# EAGLE design H09R9x (EAGLE 9.6.2)

## Sheet 1 of 2
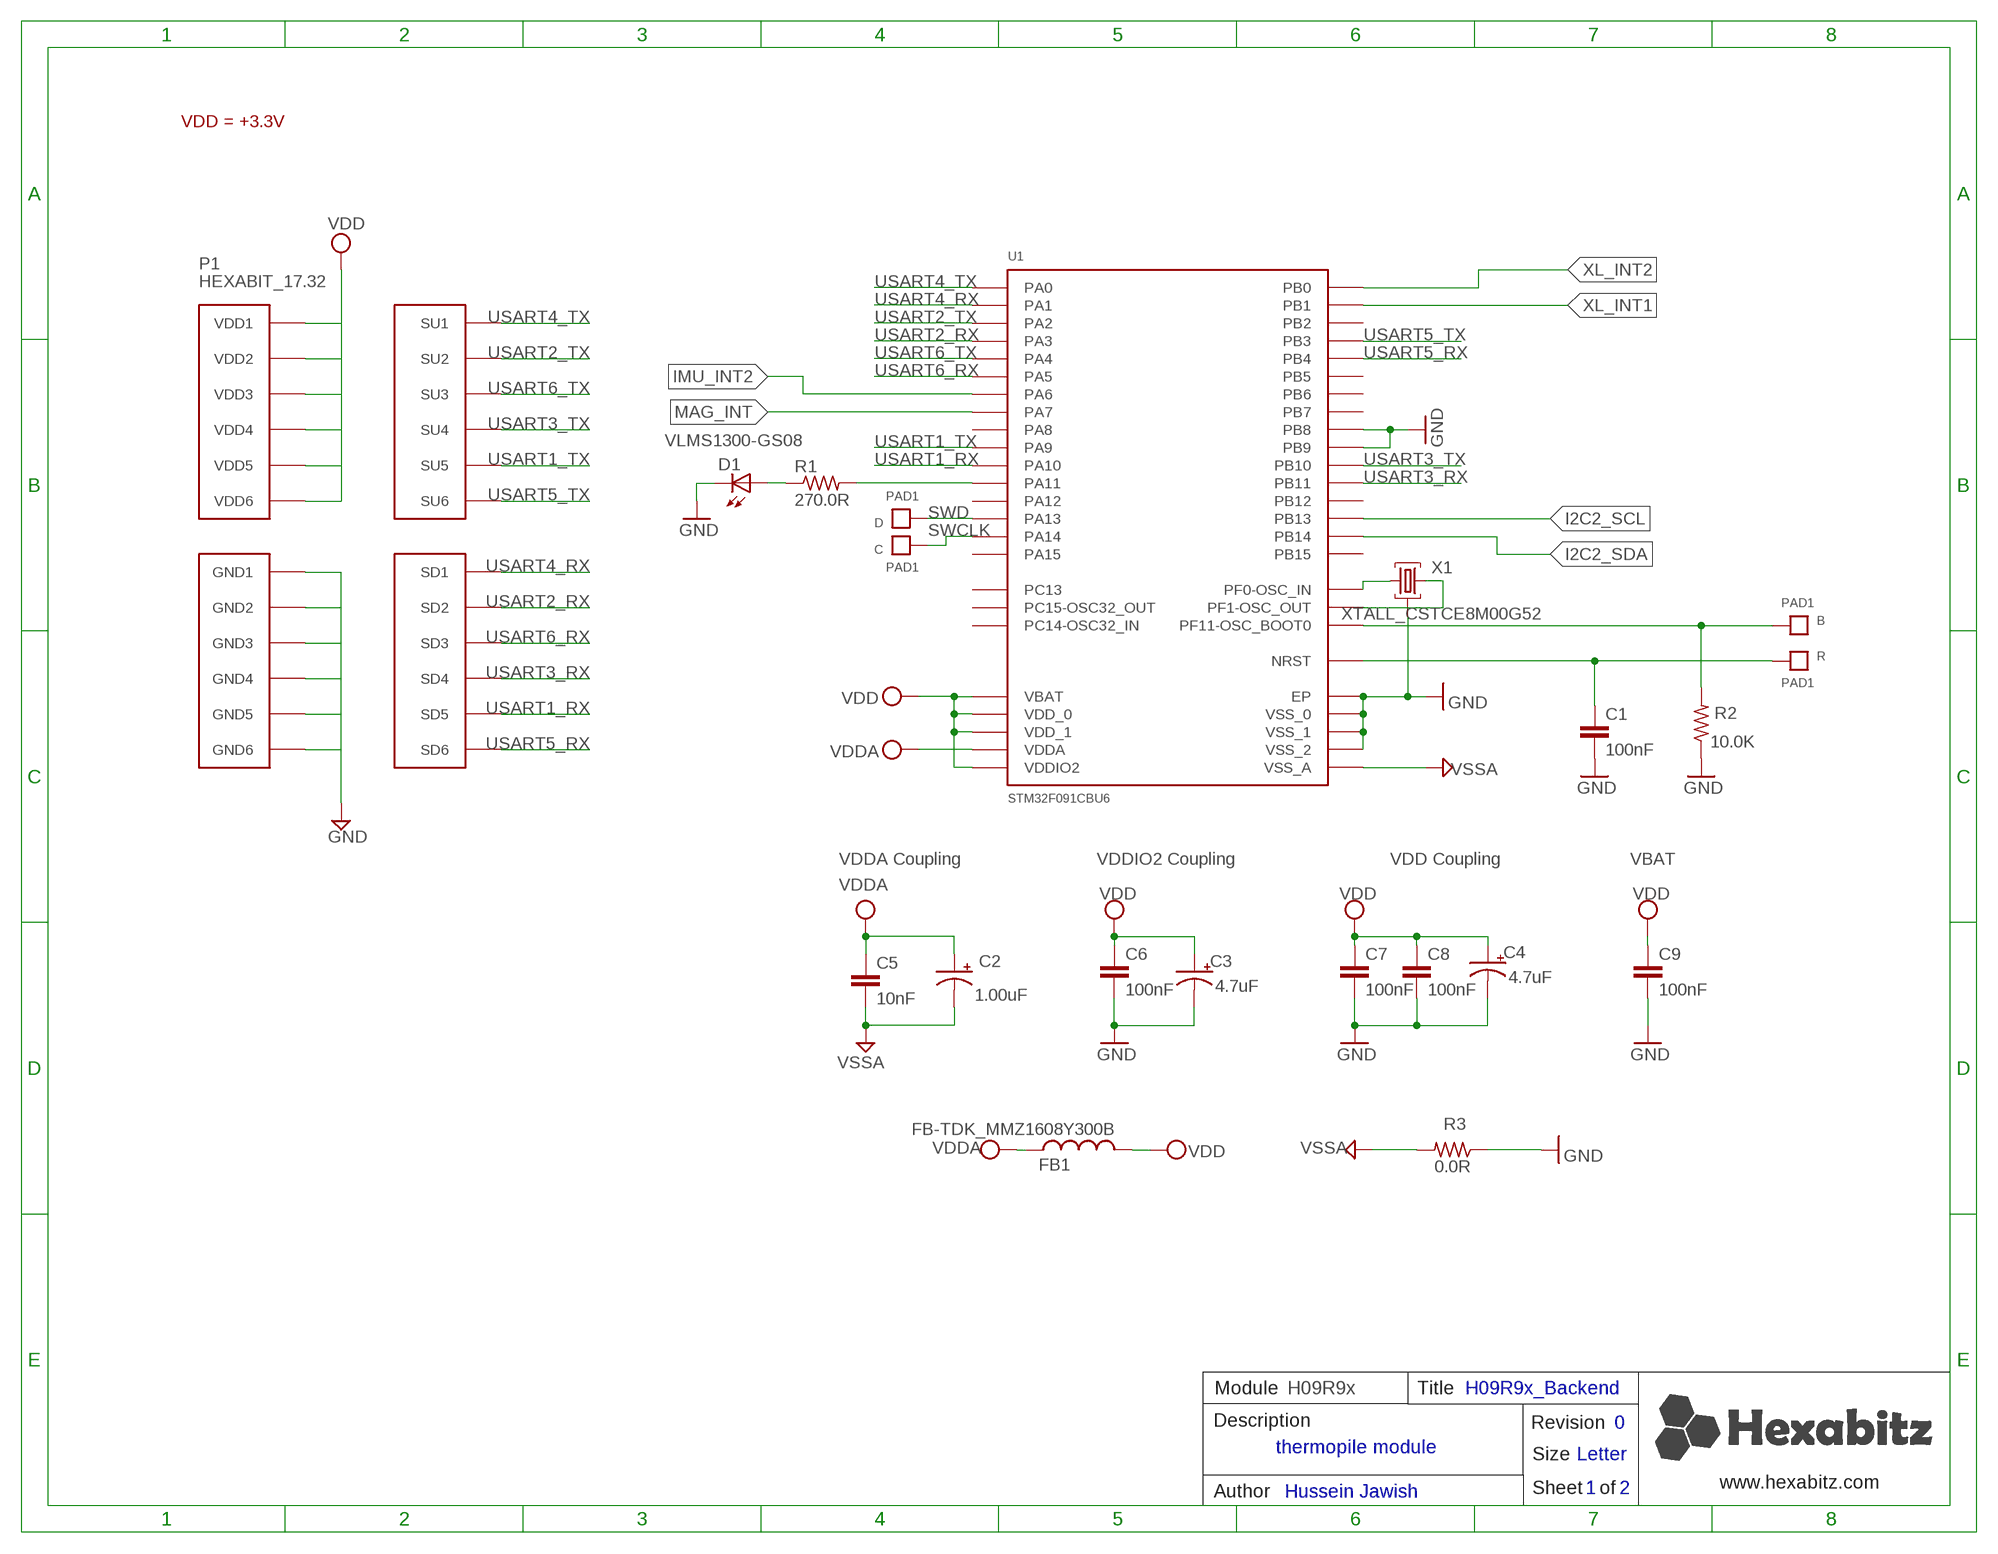
[diagram p0: schematic, sheet 1]

### Parts
B  PAD1  [PAD1]
C  PAD1  [PAD1]
C1  100nF  C-0603  [C-0603]
C2  1.00uF  C-0805-POL  [C-0805-POL]
C3  4.7uF  C-0805-POL  [C-0805-POL]
C4  4.7uF  C-0805-POL  [C-0805-POL]
C5  10nF  C-0603  [C-0603]
C6  100nF  C-0603  [C-0603]
C7  100nF  C-0603  [C-0603]
C8  100nF  C-0603  [C-0603]
C9  100nF  C-0603  [C-0603]
D  PAD1  [PAD1]
D1  VLMS1300-GS08  [VLMS1300-GS08]
FB1  FB-TDK_MMZ1608Y300B  [FB-TDK_MMZ1608Y300B]
P1  HEXABIT_17.32  [HEXABIT_17.32]
R  PAD1  [PAD1]
R1  270.0R  R-0603  [R-0603]
R2  10.0K  R-0603  [R-0603]
R3  0.0R  R-0603  [R-0603]
U1  STM32F091CBU6  [STM32F091CBU6]
X1  XTALL_CSTCE8M00G52  [XTALL_CSTCE8M00G52]

### Nets
B1: B.P$1 B.P$2 R2.2 U1.P$44(PF11-OSC_BOOT0)
GND: C1.2 C3.2(-) C4.2(-) C6.2 C7.2 C8.2 C9.2 D1.C P1.PAD_PD7(GND1) P1.PAD_PD8(GND2) P1.PAD_PD9(GND3) P1.PAD_PD10(GND4) P1.PAD_PD11(GND5) P1.PAD_PD12(GND6) R2.1 R3.1 U1.EP U1.P$23(VSS_0) U1.P$35(VSS_1) U1.P$45(PB8) U1.P$46(PB9) U1.P$47(VSS_2) X1.P$2 ; also sheet 2
I2C2_SCL: U1.P$26(PB13) ; also sheet 2
I2C2_SDA: U1.P$27(PB14) ; also sheet 2
IMU_INT2: U1.P$16(PA6)
MAG_INT: U1.P$17(PA7)
N$3: R1.2 U1.P$32(PA11)
N$4: D1.A R1.1
N$5: U1.P$5(PF0-OSC_IN) X1.P$1
N$6: U1.P$6(PF1-OSC_OUT) X1.P$3
R1: C1.1 R.P$1 R.P$2 U1.P$7(NRST)
SWCLK: C.P$1 C.P$2 U1.P$37(PA14)
SWD: D.P$1 D.P$2 U1.P$34(PA13)
USART1_RX: P1.PAD_PD5(SD5) U1.P$31(PA10)
USART1_TX: P1.PAD_PU5(SU5) U1.P$30(PA9)
USART2_RX: P1.PAD_PD2(SD2) U1.P$13(PA3)
USART2_TX: P1.PAD_PU2(SU2) U1.P$12(PA2)
USART3_RX: P1.PAD_PD4(SD4) U1.P$22(PB11)
USART3_TX: P1.PAD_PU4(SU4) U1.P$21(PB10)
USART4_RX: P1.PAD_PD1(SD1) U1.P$11(PA1)
USART4_TX: P1.PAD_PU1(SU1) U1.P$10(PA0)
USART5_RX: P1.PAD_PD6(SD6) U1.P$40(PB4)
USART5_TX: P1.PAD_PU6(SU6) U1.P$39(PB3)
USART6_RX: P1.PAD_PD3(SD3) U1.P$15(PA5)
USART6_TX: P1.PAD_PU3(SU3) U1.P$14(PA4)
VDD: C3.1(+) C4.1(+) C6.1 C7.1 C8.1 C9.1 FB1.2 P1.PAD_PU7(VDD1) P1.PAD_PU8(VDD2) P1.PAD_PU9(VDD3) P1.PAD_PU10(VDD4) P1.PAD_PU11(VDD5) P1.PAD_PU12(VDD6) U1.P$1(VBAT) U1.P$24(VDD_0) U1.P$36(VDDIO2) U1.P$48(VDD_1) ; also sheet 2
VDDA: C2.1(+) C5.1 FB1.1 U1.P$9(VDDA)
VSSA: C2.2(-) C5.2 R3.2 U1.P$8(VSS_A)
XL_INT1: U1.P$19(PB1)
XL_INT2: U1.P$18(PB0)
Unconnected: U1.P$2(PC13) U1.P$3(PC14-OSC32_IN) U1.P$4(PC15-OSC32_OUT) U1.P$20(PB2) U1.P$25(PB12) U1.P$28(PB15) U1.P$29(PA8) U1.P$33(PA12) U1.P$38(PA15) U1.P$41(PB5) U1.P$42(PB6) U1.P$43(PB7)

### Notes on the sheet
- VDD = +3.3V
- VDDA Coupling | VDDIO2 Coupling | VDD Coupling | VBAT
- Module | H09R9x | Title | H09R9x_Backend
- Description | Revision | 0
- thermopile module
- Size | Letter
- www.hexabitz.com
- Author | Hussein Jawish | Sheet   of | 1 | 2
- C:/Users/Admin/Desktop/logodraft.bmp

## Sheet 2 of 2
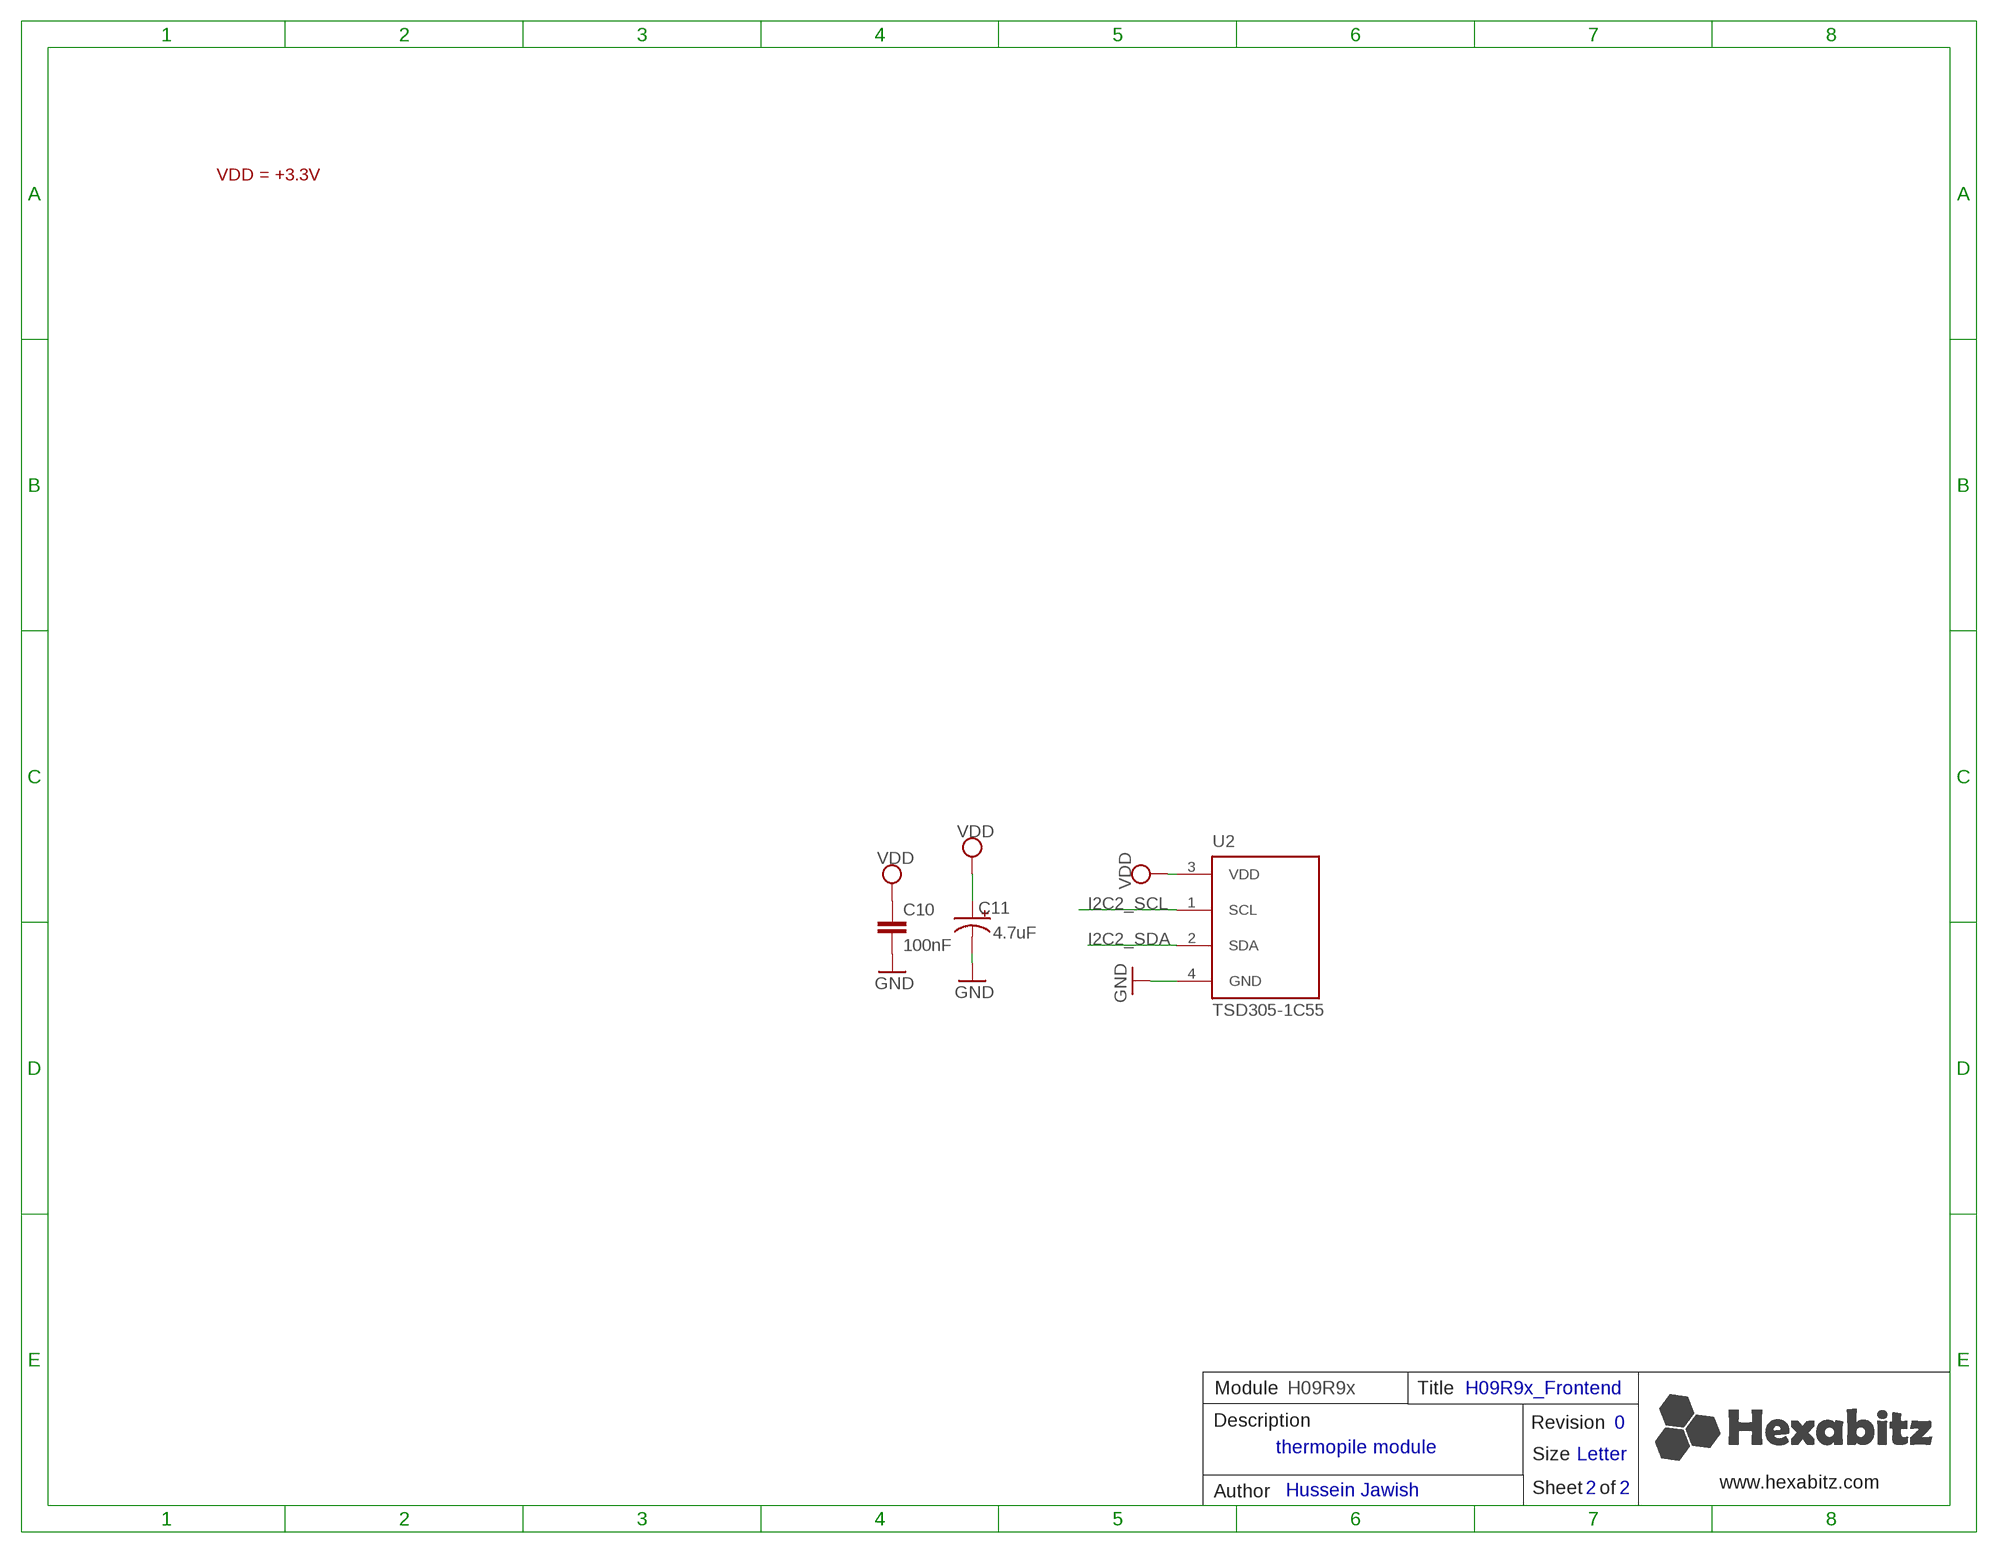
[diagram p1: schematic, sheet 2]

### Parts
C10  100nF  C-0603  [C-0603]
C11  4.7uF  C-0805-POL  [C-0805-POL]
U2  TSD305-1C55  [TEMPERATURESENSOR-TO5]

### Nets
GND: C10.2 C11.2(-) U2.4(GND) ; also sheet 1
I2C2_SCL: U2.1(SCL) ; also sheet 1
I2C2_SDA: U2.2(SDA) ; also sheet 1
VDD: C10.1 C11.1(+) U2.3(VDD) ; also sheet 1

### Notes on the sheet
- VDD = +3.3V
- Module | H09R9x | Title | H09R9x_Frontend
- Description | Revision | 0
- thermopile module
- Size | Letter
- www.hexabitz.com
- Author | Hussein Jawish | Sheet   of | 2 | 2

## Library data of the parts
B C D R = Hexabitz:PAD1
C1 C6-C8 C10 = Hexabitz:C-0603: CAP CER 10% X7R 0603; CAPACITANCE: 100nF; MFN: AVX; MPN: 0603YC104K4T2A; OCTOPART_URL: https://octopart.com/0603yc104k4t2a-avx+interconnect+%2F+elco-8120651; TOLERANCE: 10%; VOLTAGE_RATING: 16.0 V
C2 = Hexabitz:C-0805-POL: Cap Tant Solid SMD 2012; CAPACITANCE: 1.00uF; MFN: AVX; MPN: TAJR105M016RNJ; OCTOPART_URL: http://octopart.com/tajr105m016rnj-avx-1188552; TOLERANCE: 10%; VOLTAGE_RATING: 16.0 V
C3 C11 = Hexabitz:C-0805-POL: Cap Tant Solid SMD 2012; CAPACITANCE: 4.7uF; MFN: Panasonic; MPN: 10TPU4R7MSI; OCTOPART_URL: https://octopart.com/10tpu4r7msi-panasonic-29487748; TOLERANCE: 20%; VOLTAGE_RATING: 10.0 V
C4 = Hexabitz:C-0805-POL: Cap Tant Solid SMD 2012; CAPACITANCE: 4.7uF; MFN: Panasonic; MPN: 10TPU4R7MSI; OCTOPART_URL: https://octopart.com/10tpu4r7msi-panasonic-29487748; TOLERANCE: 10%; VOLTAGE_RATING: 10 V
C5 = Hexabitz:C-0603: CAP CER 10% X7R 0603; CAPACITANCE: 10nF; MFN: AVX; MPN: 0603YC103KAT4A; OCTOPART_URL: https://octopart.com/0603yc103kat4a-avx+interconnect+%2F+elco-2550362; TOLERANCE: 10%; VOLTAGE_RATING: 16.0 V
C9 = Hexabitz:C-0603: CAP CER 10% X7R 0603; CAPACITANCE: 100nF; MFN: AVX; MPN: 0603YC104K4T2A; OCTOPART_URL: https://octopart.com/0603yc104k4t2a-avx+interconnect+%2F+elco-8120651; TOLERANCE: 16.0 V; VOLTAGE_RATING: 10%
D1 = Hexabitz:VLMS1300-GS08: Red 0603 130° Clear 54 mcd 2 V Surface Mount ChipLED ; Octopart Url : http://octopart.com/vlms1300-gs08-vishay-21709201; MFN: Vishay; MPN: VLMS1300-GS08; OCTOPART_URL: https://octopart.com/vlms1300-gs08-vishay-21709201?r=sp&s=_gcP4_q8T1SC6PJQPTQ9yA
FB1 = Hexabitz:FB-TDK_MMZ1608Y300B: Ferrite Beads Multi-Layer 30Ohm 25% 100MHz 1.5A 50mOhm DCR 0603; MFN: TDK; MPN: MMZ1608Y300B; OCTOPART_URL: https://octopart.com/mmz1608y300b-tdk-368280?r=sp&s=cd9_2ZEqQ9q9UNBuQgHAiA
P1 = Hexabitz:HEXABIT_?: Hexabitz Hexagon Module Connector Hexagon side length = 17.32mm.
R1 = Hexabitz:R-0603: Thick Film Resistors - SMD 0603; MFN: Panasonic; MPN: ERJ-3GEYJ271V; OCTOPART_URL: https://octopart.com/erj-3geyj271v-panasonic-55560546; RESISTANCE: 270.0 Ohm; TOLERANCE: 5%
R2 = Hexabitz:R-0603: Thick Film Resistors - SMD 0603; MFN: Vishay; MPN: CRCW060310K0JNEB; OCTOPART_URL: https://octopart.com/crcw060310k0jneb-vishay-46603269; RESISTANCE: 10.0K Ohm; TOLERANCE: 5%
R3 = Hexabitz:R-0603: Thick Film Resistors - SMD 0603; MFN: Vishay; MPN: CRCW06030000Z0EAHP; OCTOPART_URL: https://octopart.com/crcw06030000z0eahp-vishay-44320230; RESISTANCE: 0.0 Ohm
U1 = Hexabitz:STM32F091CBU6: Description : ARM-based 32-bit MCU, CAN, 12 timers, ADC, DAC & Comm. Interface, 2 to 3.6 V, -40 to 85 degC, 48-Pin UFQFPN, RoHS, Tray ;Parameter : Ciiva URL : https://ciiva.com/part/STM32F091CBU6-20240708, CiivaID : 20240708, Clock Speed : 48000000.0 Hz, Lifecycle Status : Active, Mounting Style : Surface Mount, Number of Pins : 48, Octopart Url : https://octopart.com/stm32f091cbu6-stmicroelectronics-51988677, OctopartID : 5f4f955c32ec8088, RAM Memory Size : 32768 B, REACH SVHC Compliance : No SVHC, RoHS : Compliant,; MFN: STMicroelectronics; MPN: STM32F091CBU6; OCTOPART_URL: https://octopart.com/stm32f091cbu6-stmicroelectronics-51988677?r=sp&s=bU6fpgsrTZOxHyt7jkfh3w
U2 = HEXABITZ_ICs:TSD305-1C55: I2C DIGITAL THERMOPILE SENSOR; MFN: TE Connectivity; MPN: G-TPMO-101; OCTOPART_URL: https://octopart.com/g-tpmo-101-te+connectivity-76900424?r=sp
X1 = Hexabitz:XTALL_CSTCE8M00G52: MURATA CSTCE8M00G52-R0 RESONATOR, SMD, 8MHZ ; Octopart Url : https://octopart.com/cstce8m00g52-r0-murata-7145559; MFN: Murata; MPN: CSTCE8M00G52Z-R0; OCTOPART_URL: https://octopart.com/cstce8m00g52z-r0-murata-17755941?r=sp&s=JDnNJnrHQhyS8Zk4ofFWXw

## Board
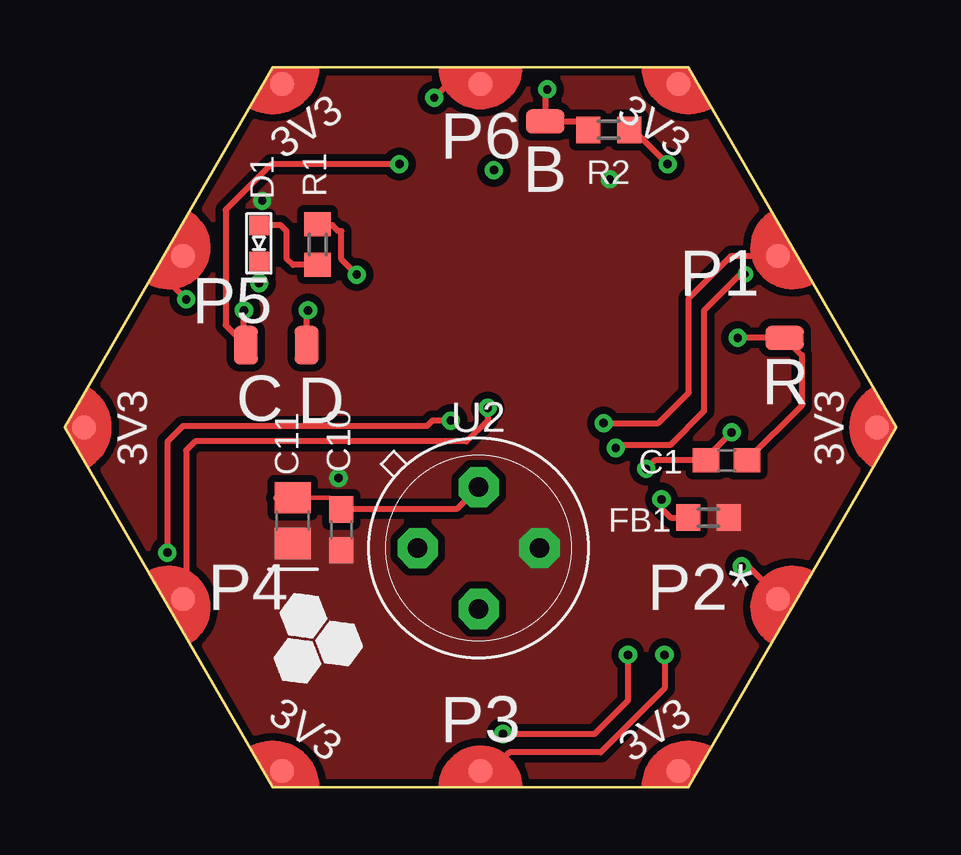
[diagram p2: board, top side]
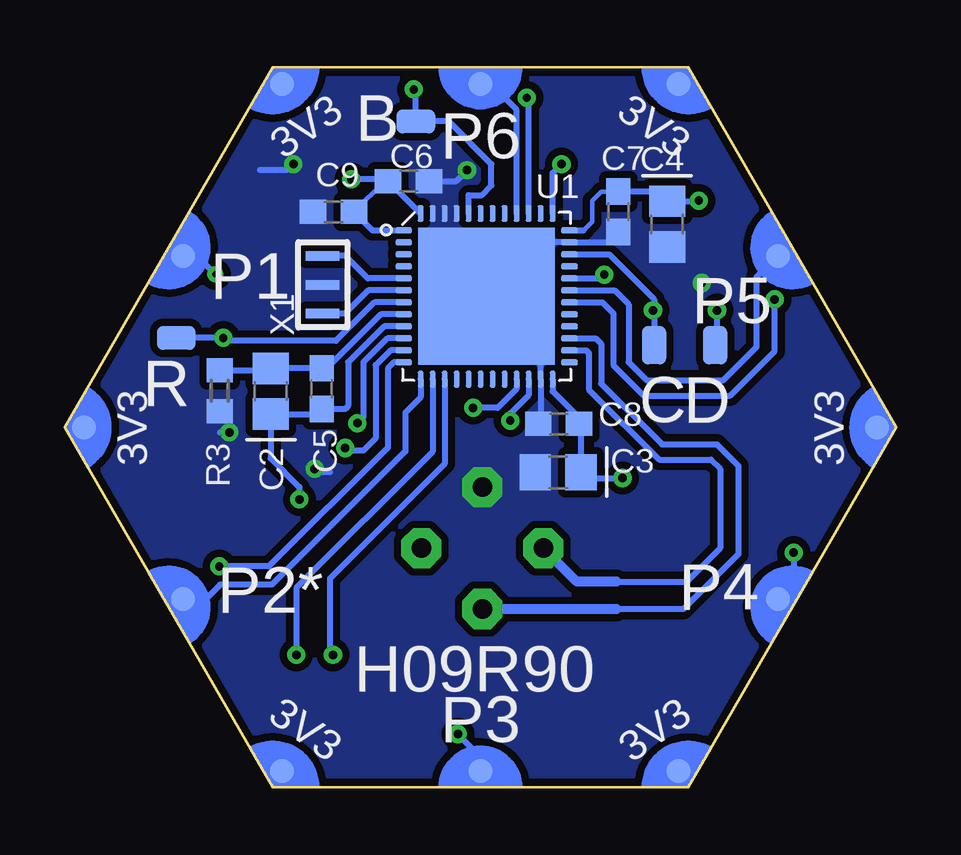
[diagram p3: board, bottom side, seen from below]

Size 34.64 x 30 mm. Coordinates in mm from the lower left corner, seen from the top.
Copper layers (1*16): Top 0.035mm / dielectric 1.5mm / Bottom 0.035mm
Design rules "2_layer": minimum track width 7mil, minimum drill 10mil, track to track 6mil, track to pad 6mil, pad to pad 6mil, via to via 6mil, smd to smd 0mil, copper to edge 1mil, drill to drill 8mil, minimum pad ring 10mil, minimum via ring 8mil, stop-mask expansion 2mil, vias tented up to drill 15mil, thermal gap 10mil

### Footprints (pad centres in the part's own frame; a part is rotated, then mirrored left to right if it is on the bottom)
PAD1 = smd 1.6 x 1: P$1 0,0 | smd 1.6 x 1 bottom: P$2 0,0
C-0603 = smd 1.1 x 1: 1 -0.85,0; 2 0.85,0
C-0805-POL = smd 1.3 x 1.5: 1 -0.95,0; 2 0.95,0
VLMS1300-GS08 = smd 0.8 x 0.8: A 0,0.75; C 0,-0.75
FB-TDK_MMZ1608Y300B = smd 1 x 1.1: 1 -0.85,0; 2 0.85,0
HEXABIT_17.32 = smd 1 x 1 bottom: PAD_PD1 12.39,7.15; PAD_PD2 12.39,-7.15; PAD_PD3 0,-14.31; PAD_PD4 -12.39,-7.15; PAD_PD5 -12.39,7.15; PAD_PD6 0,14.31; PAD_PD7 8.26,14.31; PAD_PD8 16.52,0; PAD_PD9 8.26,-14.31; PAD_PD10 -8.26,-14.31; PAD_PD11 -16.52,0; PAD_PD12 -8.26,14.31 | smd 1 x 1: PAD_PU1 12.39,7.15; PAD_PU2 12.39,-7.15; PAD_PU3 0,-14.31; PAD_PU4 -12.39,-7.15; PAD_PU5 -12.39,7.15; PAD_PU6 0,14.31; PAD_PU7 8.26,14.31; PAD_PU8 16.52,0; PAD_PU9 8.26,-14.31; PAD_PU10 -8.26,-14.31; PAD_PU11 -16.52,0; PAD_PU12 -8.26,14.31
R-0603 = smd 1 x 1.1: 1 -0.85,0; 2 0.85,0
STM32F091CBU6 = smd 5.7 x 5.7: EP 0,0 | smd 0.25 x 0.7: P$1 -2.75,-3.45; P$2 -2.25,-3.45; P$3 -1.75,-3.45; P$4 -1.25,-3.45; P$5 -0.75,-3.45; P$6 -0.25,-3.45; P$7 0.25,-3.45; P$8 0.75,-3.45; P$9 1.25,-3.45; P$10 1.75,-3.45; P$11 2.25,-3.45; P$12 2.75,-3.45; P$25 2.75,3.45; P$26 2.25,3.45; P$27 1.75,3.45; P$28 1.25,3.45; P$29 0.75,3.45; P$30 0.25,3.45; P$31 -0.25,3.45; P$32 -0.75,3.45; P$33 -1.25,3.45; P$34 -1.75,3.45; P$35 -2.25,3.45; P$36 -2.75,3.45 | smd 0.7 x 0.25: P$13 3.45,-2.75; P$14 3.45,-2.25; P$15 3.45,-1.75; P$16 3.45,-1.25; P$17 3.45,-0.75; P$18 3.45,-0.25; P$19 3.45,0.25; P$20 3.45,0.75; P$21 3.45,1.25; P$22 3.45,1.75; P$23 3.45,2.25; P$24 3.45,2.75; P$37 -3.45,2.75; P$38 -3.45,2.25; P$39 -3.45,1.75; P$40 -3.45,1.25; P$41 -3.45,0.75; P$42 -3.45,0.25; P$43 -3.45,-0.25; P$44 -3.45,-0.75; P$45 -3.45,-1.25; P$46 -3.45,-1.75; P$47 -3.45,-2.25; P$48 -3.45,-2.75
TEMPERATURESENSOR-TO5 = drill 0.813 pad 1.676 octagon: 1 2.54,0; 2 0,2.54; 3 -2.54,0; 4 0,-2.54
XTALL_CSTCE8M00G52 = smd 1.4 x 0.4: P$1 0,1.2; P$2 0,0; P$3 0,-1.2

### Placement (x,y rotation side)
B  20.01,27.75 0 top
C  7.54,18.43 90 top
C1  27.57,13.62 180 top
C2  26.06,16.51 90 bottom
C3  14.08,13.13 180 bottom
C4  9.54,23.47 270 bottom
C5  23.93,16.62 90 bottom
C6  20.32,25.26 0 bottom
C7  11.57,23.99 270 bottom
C8  14.06,15.15 180 bottom
C9  23.44,23.98 180 bottom
C10  11.53,10.73 90 top
C11  9.5,11.11 90 top
D  10.08,18.43 270 top
D1  8.09,22.67 0 top
FB1  26.82,11.24 0 top
P1  17.32,15 0 top
R  29.99,18.73 180 top
R1  10.53,22.62 90 top
R2  22.67,27.4 180 top
R3  28.18,16.53 90 bottom
U1  17.07,20.46 270 bottom
U2  17.24,9.97 180 top
X1  23.9,20.94 0 bottom

### Tracks (layer width: path | path; a pad name or v marks a point on that pad's centre or on a via)
B1  (via drill 0.35)
  Top 0.254: R2.2 21.47,27.75 B.P$1 20.01,29 v20.1,29.08
  Bottom 0.254: U1.P$44 17.82,24.68 17.27,24.68 16.86,25.08 16.86,25.97 18.64,27.75 B.P$1 20.01,29.12 20.04,29.15 v20.1,29.08
GND  (via drill 0.35)
  Top 0.178: C11.2 11.05,12.06 C10.2 11.57,11.62 11.82,11.62
  Top 0.254: v24.23,13.27 24.58,13.62 C1.2 26.72,13.74 v27.78,14.8 | 7.85,22.16 D1.C v8.1,21.02 | v25.12,25.97 23.6,27.49 R2.1 | U2.4 16.35,11.62 11.82,11.62 | 9.44,12 C11.2 8.8,12.06
  Bottom 0.254: 11.66,23.05 C7.2 12,22.71 U1.P$35 16.31,22.71 17.75,21.27 17.75,20.51 17.7,20.46 U1.EP 16.68,20.46 15.72,19.5 15.72,18.86 14.82,17.96 U1.P$23 14.82,15.25 C8.2 | 9.56,22.5 C4.2 | v17.88,25.72 18.34,25.26 C6.2 | v24.23,13.27 24.1,13.15 23.59,13.15 | v25.12,25.97 25.37,25.72 26.51,25.72 | v27.78,14.8 28.17,14.8
  pour Bottom (isolate 0.305, no thermals): 8.66,0 26.04,0 34.6,14.82 25.83,30 8.66,30 0,15
I2C2_SCL
  Bottom 0.254: U1.P$26 12.91,18.21 12.8,18.1 12.8,16.57 9.88,13.65 7.72,13.65 7.34,13.27 7.34,9.97 8.73,8.57 11.66,8.57
  Bottom 0.406: 11.66,8.57 13.31,8.57 U2.1
I2C2_SDA
  Bottom 0.254: U1.P$27 12.52,18.71 12.29,18.48 12.29,16.83 9.75,14.29 7.46,14.29 6.58,13.4 6.58,9.72 8.86,7.43 11.66,7.43
  Bottom 0.406: 11.66,7.43 U2.2
N$3  (via drill 0.35)
  Top 0.254: R1.2 10.57,23.43 11.15,23.43 11.4,23.18 11.53,23.18 11.53,22 v12.16,21.37
  Bottom 0.254: U1.P$32 12.35,21.21 12.2,21.37 v12.16,21.37
N$4
  Top 0.254: R1.1 9.51,21.77 9.24,22.04 9.24,23.18 8.99,23.43 8.11,23.43 D1.A
N$5
  Bottom 0.254: U1.P$5 22.01,21.21 22.96,22.16 23.87,22.16 X1.P$1
N$6
  Bottom 0.254: U1.P$6 22,20.71 22.97,19.74 X1.P$3
R1  (via drill 0.35)
  Top 0.254: C1.1 30.71,15.91 30.71,18.02 R.P$1 v28.04,18.73
  Bottom 0.254: R.P$1 v28.04,18.73 27.91,18.61 23.34,18.61 21.74,20.21 U1.P$7
SWCLK  (via drill 0.35)
  Top 0.254: v13.94,25.97 8.61,25.97 6.7,24.07 6.7,19.27 C.P$1 7.46,18.5 v7.46,19.88
  Bottom 0.254: U1.P$37 14.32,25.6 v13.94,25.97 | v7.46,19.88 7.46,18.5 C.P$1
SWD  (via drill 0.35)
  Top 0.254: D.P$1 10.08,19.93 v10.13,19.88
  Bottom 0.254: U1.P$34 11.96,22.21 10.08,20.33 10.08,19.83 | 10.08,19.83 D.P$1 | v10.13,19.88 10.08,19.83
USART1_RX
  Bottom 0.254: U1.P$31 11.73,20.71 11.15,20.13 11.15,17.72 10.39,16.96 7.21,16.96 5.82,18.35 5.82,21.26 P1.PAD_PD5
USART1_TX  (via drill 0.35)
  Top 0.254: v5.06,20.33 4.54,20.85 4.54,21.76 P1.PAD_PU5
  Bottom 0.254: U1.P$30 12.24,20.21 11.78,19.75 11.78,17.59 10.51,16.32 6.92,16.32 5.06,18.18 v5.06,20.33
USART2_RX
  Bottom 0.254: U1.P$13 19.82,16.25 20.45,15.61 20.45,14 26.01,8.45 28.17,8.45 29.05,7.56 29.05,7.43 29.29,7.43 P1.PAD_PD2 29.73,7.83
USART2_TX  (via drill 0.35)
  Top 0.254: P1.PAD_PU2 29.71,7.98 28.48,9.21 v28.21,9.21
  Bottom 0.254: U1.P$12 20.93,17.71 21.18,17.46 21.18,14.16 26.13,9.21 v28.21,9.21
USART3_RX  (via drill 0.35)
  Top 0.254: v16.08,15.28 15.32,15.28 15.08,15.05 4.92,15.05 4.27,14.4 v4.27,9.78
  Bottom 0.254: U1.P$22 15.32,16.34 16.08,15.58 v16.08,15.28 | v4.27,9.78 4.27,8.34 4.76,7.85 P1.PAD_PD4
USART3_TX  (via drill 0.35)
  Top 0.254: P1.PAD_PU4 5.06,7.98 5.06,14.04 5.43,14.42 16.74,14.42 17.62,15.3 v17.62,15.81
  Bottom 0.254: U1.P$21 15.82,16.61 16.61,15.81 v17.62,15.81
USART4_RX  (via drill 0.25, 0.35)
  Top 0.254: v22.96,14.14 23.08,14.27 25.22,14.27 26.64,15.69 26.64,19.88 28.17,21.4 28.42,21.4 28.39,21.38 v28.36,21.38
  Bottom 0.254: U1.P$11 21.07,18.21 21.69,17.59 21.69,14.54 22.2,14.03 22.96,14.03 v22.96,14.14 | v28.36,21.38 29.14,22.15 P1.PAD_PD1
USART4_TX  (via drill 0.35)
  Top 0.254: v22.45,15.18 24.74,15.18 26.01,16.45 26.01,20.38 27.77,22.15 P1.PAD_PU1
  Bottom 0.254: U1.P$10 21.2,18.71 22.2,17.72 22.2,15.43 v22.45,15.18
USART5_RX
  Bottom 0.254: U1.P$40 15.82,28.23 16.9,29.31 P1.PAD_PD6
USART5_TX  (via drill 0.35)
  Top 0.254: v15.39,28.73 15.97,29.31 P1.PAD_PU6
  Bottom 0.254: U1.P$39 15.32,28.62 15.47,28.77 15.42,28.77 v15.39,28.73
USART6_RX  (via drill 0.35)
  Top 0.254: v23.47,5.53 23.47,3.62 22.07,2.22 v18.26,2.22
  Bottom 0.254: U1.P$15 18.82,13.48 23.59,8.7 23.59,5.53 v23.47,5.53 | v18.26,2.22 17.32,1.28 P1.PAD_PD3
USART6_TX  (via drill 0.35)
  Top 0.254: P1.PAD_PU3 17.75,0.69 18.52,1.46 22.32,1.46 24.99,4.13 v24.99,5.53
  Bottom 0.254: U1.P$14 19.32,13.99 24.99,8.32 v24.99,5.53
VDD  (via drill 0.35)
  Top 0.254: 9.78,9.88 C11.1
  Bottom 0.178: C9.1 21.31,25.26 C6.1 | 13.02,23.21 12.67,23.56 12.67,24.45 12.29,24.83 C7.1
  Bottom 0.254: U1.P$36 13.02,23.21 | 11.57,24.41 C7.1 9.96,24.84 C4.1 8.25,24.42 v8.23,24.45 | U1.P$24 14.32,16.5 13.21,15.4 C8.1 13.13,15.07 C3.1 12.9,12.89 v11.4,12.89 | U1.P$1 21.82,23.21 C9.1 | U1.P$48 C6.1 21.24,25.34 v22.7,25.34
  pour Top (isolate 0.305, no thermals): 8.66,0 25.98,0 34.64,15 25.98,30 8.66,30 0,15
VDDA  (via drill 0.35)
  Top 0.254: v24.86,12 24.86,11.62 25.24,11.24 FB1.1
  Bottom 0.254: U1.P$9 21.34,19.21 22.83,17.72 22.83,15.89 22.96,15.77 C5.1 24.14,15.56 C2.1 26.06,13.71 24.86,12.51 v24.86,12
VSSA
  Bottom 0.254: U1.P$8 21.47,19.71 23.72,17.47 C5.2 26.05,17.47 C2.2 26.14,17.38 R3.2

### Text on the board
tPlace: 3V3 | P6 | 3V3 | P1 | P5 | 3V3 | 3V3 | P4 | P2* | 3V3 | P3 | 3V3
bPlace: 3V3 | P6 | 3V3 | P1 | P5 | 3V3 | 3V3 | P4 | P2* | H09R90 | 3V3 | P3 | 3V3
bNames: B | D | R | C